# EAGLE schematic OSO-BOOK-A1-06 (EAGLE 9.6.2)

## Sheet 1 of 3
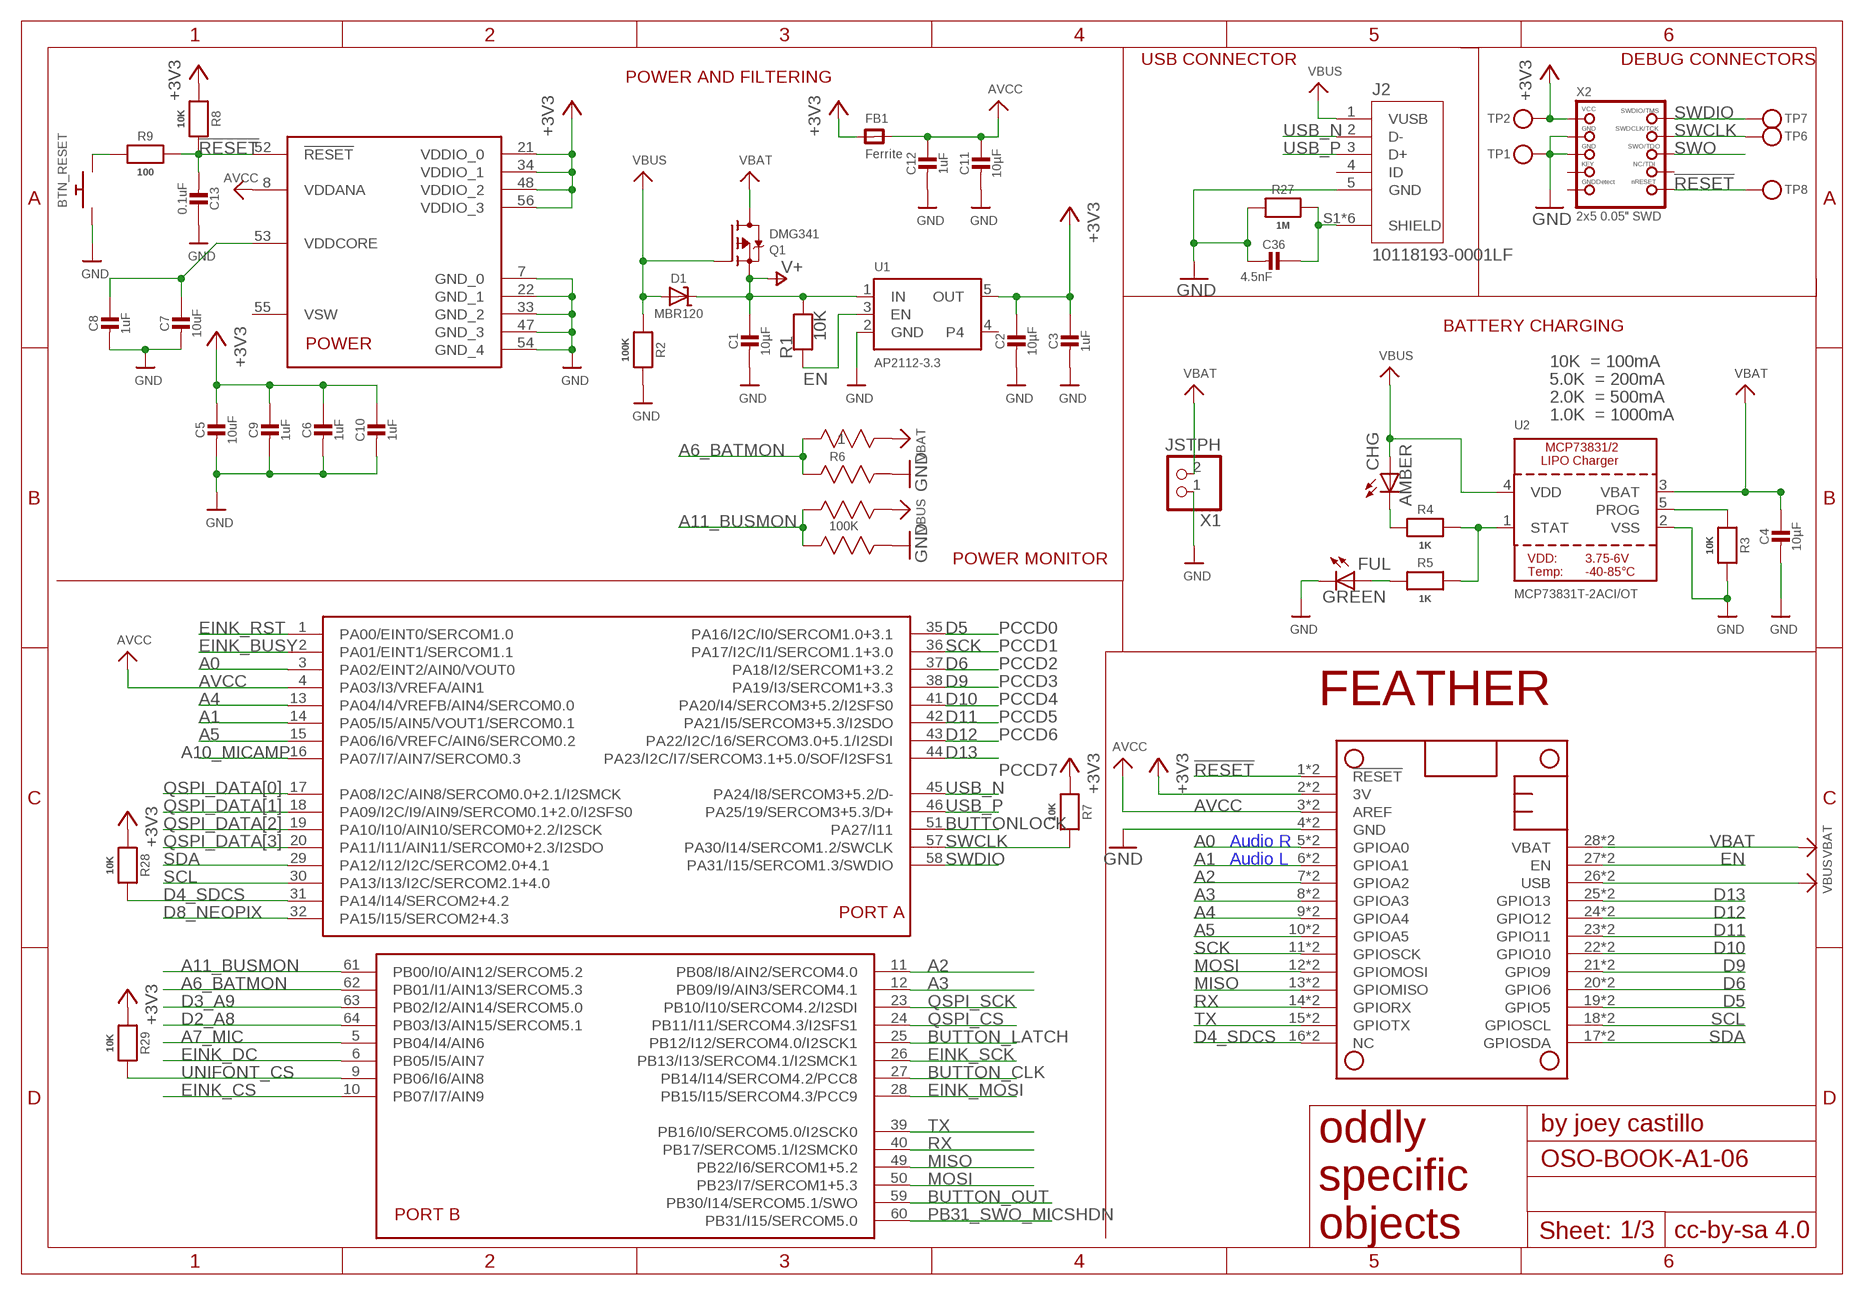
[diagram p0: schematic, sheet 1]

### Parts
BTN_RESET  SPST_TACTILE_SWITCHRA  [TL3330AF130QG]
C1  10µF  CAP_CERAMIC0805-NOOUTLINE  [0805-NO]
C2  10µF  CAP_CERAMIC0805-NOOUTLINE  [0805-NO]
C3  1uF  CAP_CERAMIC0805-NOOUTLINE  [0805-NO]
C4  10µF  CAP_CERAMIC0805-NOOUTLINE  [0805-NO]
C5  10uF  CAP_CERAMIC0805_10MGAP  [0805_10MGAP]
C6  1uF  CAP_CERAMIC0805_10MGAP  [0805_10MGAP]
C7  10uF  CAP_CERAMIC0805_10MGAP  [0805_10MGAP]
C8  1uF  CAP_CERAMIC0805_10MGAP  [0805_10MGAP]
C9  1uF  CAP_CERAMIC0805-NOOUTLINE  [0805-NO]
C10  1uF  CAP_CERAMIC0805_10MGAP  [0805_10MGAP]
C11  10µF  CAP_CERAMIC0805-NOOUTLINE  [0805-NO]
C12  1uF  CAP_CERAMIC0805-NOOUTLINE  [0805-NO]
C13  0.1uF  CAP_CERAMIC0805_10MGAP  [0805_10MGAP]
C36  4.5nF  CAP_CERAMIC0805-NOOUTLINE  [0805-NO]
CHG  AMBER  LEDCHIP-LED0805  [CHIP-LED0805]
D1  MBR120  DIODE-SCHOTTKYSOD-123  [SOD-123]
FB1  Ferrite  FERRITE0805  [0805]
FUL  GREEN  LEDCHIP-LED0805  [CHIP-LED0805]
J2  10118193-0001LF  [FCI_10118193-0001LF]
MS1  FEATHERWING_SMTDUAL  [FEATHERWING_SMT2]
Q1  DMG341  MOSFET-P  [SOT23-R]
R1  10K  RESISTOR0805_NOOUTLINE  [0805-NO]
R2  100K  RESISTOR0805_NOOUTLINE  [0805-NO]
R3  10K  RESISTOR0805_NOOUTLINE  [0805-NO]
R4  1K  RESISTOR0805_NOOUTLINE  [0805-NO]
R5  1K  RESISTOR0805_NOOUTLINE  [0805-NO]
R6  100K  EXB-V8V103JV  [EXBV8V]
R7  10K  RESISTOR0805_10MGAP  [0805_10MGAP]
R8  10K  RESISTOR0805_10MGAP  [0805_10MGAP]
R9  100  RESISTOR0805_10MGAP  [0805_10MGAP]
R27  1M  RESISTOR0805_NOOUTLINE  [0805-NO]
R28  10K  RESISTOR0805_10MGAP  [0805_10MGAP]
R29  10K  RESISTOR0805_10MGAP  [0805_10MGAP]
TP1  TESTPOINTROUND2MMNO  [TESTPOINT_ROUND_2MM_NO]
TP2  TESTPOINTROUND2MMNO  [TESTPOINT_ROUND_2MM_NO]
TP6  TESTPOINTROUND2MMNO  [TESTPOINT_ROUND_2MM_NO]
TP7  TESTPOINTROUND2MMNO  [TESTPOINT_ROUND_2MM_NO]
TP8  TESTPOINTROUND2MMNO  [TESTPOINT_ROUND_2MM_NO]
U1  AP2112-3.3  VREG_SOT23-5  [SOT23-5]
U2  MCP73831T-2ACI/OT  MCP73831/2  [SOT23-5]
U3  ATSAMD51J64-TQFP(10X10)  [TQFP64-10X10]
X1  JSTPH  CON_JST_PH_2PIN  [JSTPH2]
X2  2x5 0.05" SWD  JTAG-CORTEXBOXPOSTS  [2X05_1.27MM_BOX_POSTS]

### Nets
!RESET: C13.2 MS1.1'(!RESET) MS1.1(!RESET) R8.2 R9.2 TP8.P$1 U3.52(!RESET) X2.10(NRESET)
+3V3 [power]: C2.1 C3.1 C5.1 C6.1 C9.1 C10.1 FB1.1 MS1.2'(3V) MS1.2(3V) R7.1 R8.1 R28.1 R29.1 TP2.P$1 U1.5(OUT) U3.21(VDDIO_0) U3.34(VDDIO_1) U3.48(VDDIO_2) U3.56(VDDIO_3) X2.1(VCC) ; also sheet 2,3
A0: MS1.5'(GPIOA0) MS1.5(GPIOA0) U3.3(PA02/EINT2/AIN0/VOUT0) ; also sheet 2
A1: MS1.6'(GPIOA1) MS1.6(GPIOA1) U3.14(PA05/I5/AIN5/VOUT1/SERCOM0.1) ; also sheet 2
A2: MS1.7'(GPIOA2) MS1.7(GPIOA2) U3.11(PB08/I8/AIN2/SERCOM4.0)
A3: MS1.8'(GPIOA3) MS1.8(GPIOA3) U3.12(PB09/I9/AIN3/SERCOM4.1)
A4: MS1.9'(GPIOA4) MS1.9(GPIOA4) U3.13(PA04/I4/VREFB/AIN4/SERCOM0.0)
A5: MS1.10'(GPIOA5) MS1.10(GPIOA5) U3.15(PA06/I6/VREFC/AIN6/SERCOM0.2)
A6_BATMON: R6.1 R6.2 U3.62(PB01/I1/AIN13/SERCOM5.3)
A7_MIC: U3.5(PB04/I4/AIN6) ; also sheet 2,3
A10_MICAMP: U3.16(PA07/I7/AIN7/SERCOM0.3) ; also sheet 3
A11_BUSMON: R6.3 R6.4 U3.61(PB00/I0/AIN12/SERCOM5.2)
AVCC [power]: C11.1 C12.1 FB1.2 MS1.3'(AREF) MS1.3(AREF) U3.4(PA03/I3/VREFA/AIN1) U3.8(VDDANA) ; also sheet 2,3
BUTTON_CLK: U3.27(PB14/I14/SERCOM4.2/PCC8) ; also sheet 2
BUTTON_LATCH: U3.25(PB12/I12/SERCOM4.0/I2SCK1) ; also sheet 2
BUTTON_OUT: U3.59(PB30/I14/SERCOM5.1/SWO) ; also sheet 2
BUTTONLOCK: U3.51(PA27/I11) ; also sheet 2
D2_A8: U3.64(PB03/I3/AIN15/SERCOM5.1) ; also sheet 2
D3_A9: U3.63(PB02/I2/AIN14/SERCOM5.0) ; also sheet 2
D4_SDCS: MS1.16'(NC) MS1.16(NC) R28.2 U3.31(PA14/I14/SERCOM2+4.2) ; also sheet 2
D5: MS1.19'(GPIO5) MS1.19(GPIO5) U3.35(PA16/I2C/I0/SERCOM1.0+3.1)
D6: MS1.20'(GPIO6) MS1.20(GPIO6) U3.37(PA18/I2/SERCOM1+3.2)
D8_NEOPIX: U3.32(PA15/I15/SERCOM2+4.3) ; also sheet 2
D9: MS1.21'(GPIO9) MS1.21(GPIO9) U3.38(PA19/I3/SERCOM1+3.3)
D10: MS1.22'(GPIO10) MS1.22(GPIO10) U3.41(PA20/I4/SERCOM3+5.2/I2SFS0)
D11: MS1.23'(GPIO11) MS1.23(GPIO11) U3.42(PA21/I5/SERCOM3+5.3/I2SDO)
D12: MS1.24'(GPIO12) MS1.24(GPIO12) U3.43(PA22/I2C/16/SERCOM3.0+5.1/I2SDI)
D13: MS1.25'(GPIO13) MS1.25(GPIO13) U3.44(PA23/I2C/I7/SERCOM3.1+5.0/SOF/I2SFS1) ; also sheet 2
EINK_BUSY: U3.2(PA01/EINT1/SERCOM1.1) ; also sheet 2
EINK_CS: U3.10(PB07/I7/AIN9) ; also sheet 2
EINK_DC: U3.6(PB05/I5/AIN7) ; also sheet 2
EINK_MOSI: U3.28(PB15/I15/SERCOM4.3/PCC9) ; also sheet 2
EINK_RST: U3.1(PA00/EINT0/SERCOM1.0) ; also sheet 2
EINK_SCK: U3.26(PB13/I13/SERCOM4.1/I2SMCK1) ; also sheet 2
EN: MS1.27'(EN) MS1.27(EN) R1.1 U1.3(EN) ; also sheet 2
GND [gnd]: BTN_RESET.P$1 C1.2 C2.2 C3.2 C4.2 C5.2 C6.2 C7.2 C8.2 C9.2 C10.2 C11.2 C12.2 C13.1 C36.2 FUL.C J2.5(GND) MS1.4'(GND) MS1.4(GND) R2.2 R3.2 R6.5 R6.7 R27.2 TP1.P$1 U1.2(GND) U2.2(VSS) U3.7(GND_0) U3.22(GND_1) U3.33(GND_2) U3.47(GND_3) U3.54(GND_4) X1.1 X2.3(GND) X2.5(GND) ; also sheet 2,3
MISO: MS1.13'(GPIOMISO) MS1.13(GPIOMISO) U3.49(PB22/I6/SERCOM1+5.2) ; also sheet 2
MOSI: MS1.12'(GPIOMOSI) MS1.12(GPIOMOSI) U3.50(PB23/I7/SERCOM1+5.3) ; also sheet 2
N$1: BTN_RESET.P$2 R9.1
N$4: CHG.C R4.1
N$9: FUL.A R5.1
PB31_SWO_MICSHDN: U3.60(PB31/I15/SERCOM5.0) ; also sheet 3
PROG: R3.1 U2.5(PROG)
QSPI_CS: U3.24(PB11/I11/SERCOM4.3/I2SFS1) ; also sheet 2
QSPI_DATA[0]: U3.17(PA08/I2C/AIN8/SERCOM0.0+2.1/I2SMCK) ; also sheet 2
QSPI_DATA[1]: U3.18(PA09/I2C/I9/AIN9/SERCOM0.1+2.0/I2SFS0) ; also sheet 2
QSPI_DATA[2]: U3.19(PA10/I10/AIN10/SERCOM0+2.2/I2SCK) ; also sheet 2
QSPI_DATA[3]: U3.20(PA11/I11/AIN11/SERCOM0+2.3/I2SDO) ; also sheet 2
QSPI_SCK: U3.23(PB10/I10/SERCOM4.2/I2SDI) ; also sheet 2
RX: MS1.14'(GPIORX) MS1.14(GPIORX) U3.40(PB17/SERCOM5.1/I2SMCK0) ; also sheet 2
SCK: MS1.11'(GPIOSCK) MS1.11(GPIOSCK) U3.36(PA17/I2C/I1/SERCOM1.1+3.0) ; also sheet 2
SCL: MS1.18'(GPIOSCL) MS1.18(GPIOSCL) U3.30(PA13/I13/I2C/SERCOM2.1+4.0) ; also sheet 2
SDA: MS1.17'(GPIOSDA) MS1.17(GPIOSDA) U3.29(PA12/I12/I2C/SERCOM2.0+4.1) ; also sheet 2
SHIELD [gnd]: C36.1 J2.S1(SHIELD) J2.S2(SHIELD) J2.S3(SHIELD) J2.S4(SHIELD) J2.S5(SHIELD) J2.S6(SHIELD) R27.1
STAT: R4.2 R5.2 U2.1(STAT)
SWCLK: R7.2 TP6.P$1 U3.57(PA30/I14/SERCOM1.2/SWCLK) X2.4(SWDCLK)
SWDIO: TP7.P$1 U3.58(PA31/I15/SERCOM1.3/SWDIO) X2.2(SWDIO)
SWO: X2.6(SWO) ; also sheet 3
TX: MS1.15'(GPIOTX) MS1.15(GPIOTX) U3.39(PB16/I0/SERCOM5.0/I2SCK0) ; also sheet 2
UNIFONT_CS: R29.2 U3.9(PB06/I6/AIN8) ; also sheet 2
USB_N: J2.2(D-) U3.45(PA24/I8/SERCOM3+5.2/D-)
USB_P: J2.3(D+) U3.46(PA25/19/SERCOM3+5.3/D+)
V+ [power]: C1.1 D1.C Q1.2(S) R1.2 U1.1(IN)
VBAT [power]: C4.1 MS1.28'(VBAT) MS1.28(VBAT) Q1.3(D) R6.8 U2.3(VBAT) X1.2
VBUS [power]: CHG.A D1.A J2.1(VUSB) MS1.26'(USB) MS1.26(USB) Q1.1(G) R2.1 R6.6 U2.4(VDD)
VDDCORE2 [gnd]: C7.1 C8.1 U3.53(VDDCORE)
Unconnected: J2.4(ID) U1.4 U3.55(VSW) X2.7(KEY) X2.8(TDI) X2.9(GNDDETECT)

### Notes on the sheet
- USB CONNECTOR | DEBUG CONNECTORS
- POWER AND FILTERING
- BATTERY CHARGING
- 10K  = 100mA
- 5.0K  = 200mA
- 2.0K  = 500mA
- 1.0K  = 1000mA
- POWER MONITOR
- PCCD0
- PCCD1
- PCCD2
- PCCD3
- PCCD4 | FEATHER
- PCCD5
- PCCD6
- PCCD7
- Audio R
- Audio L

## Sheet 2 of 3
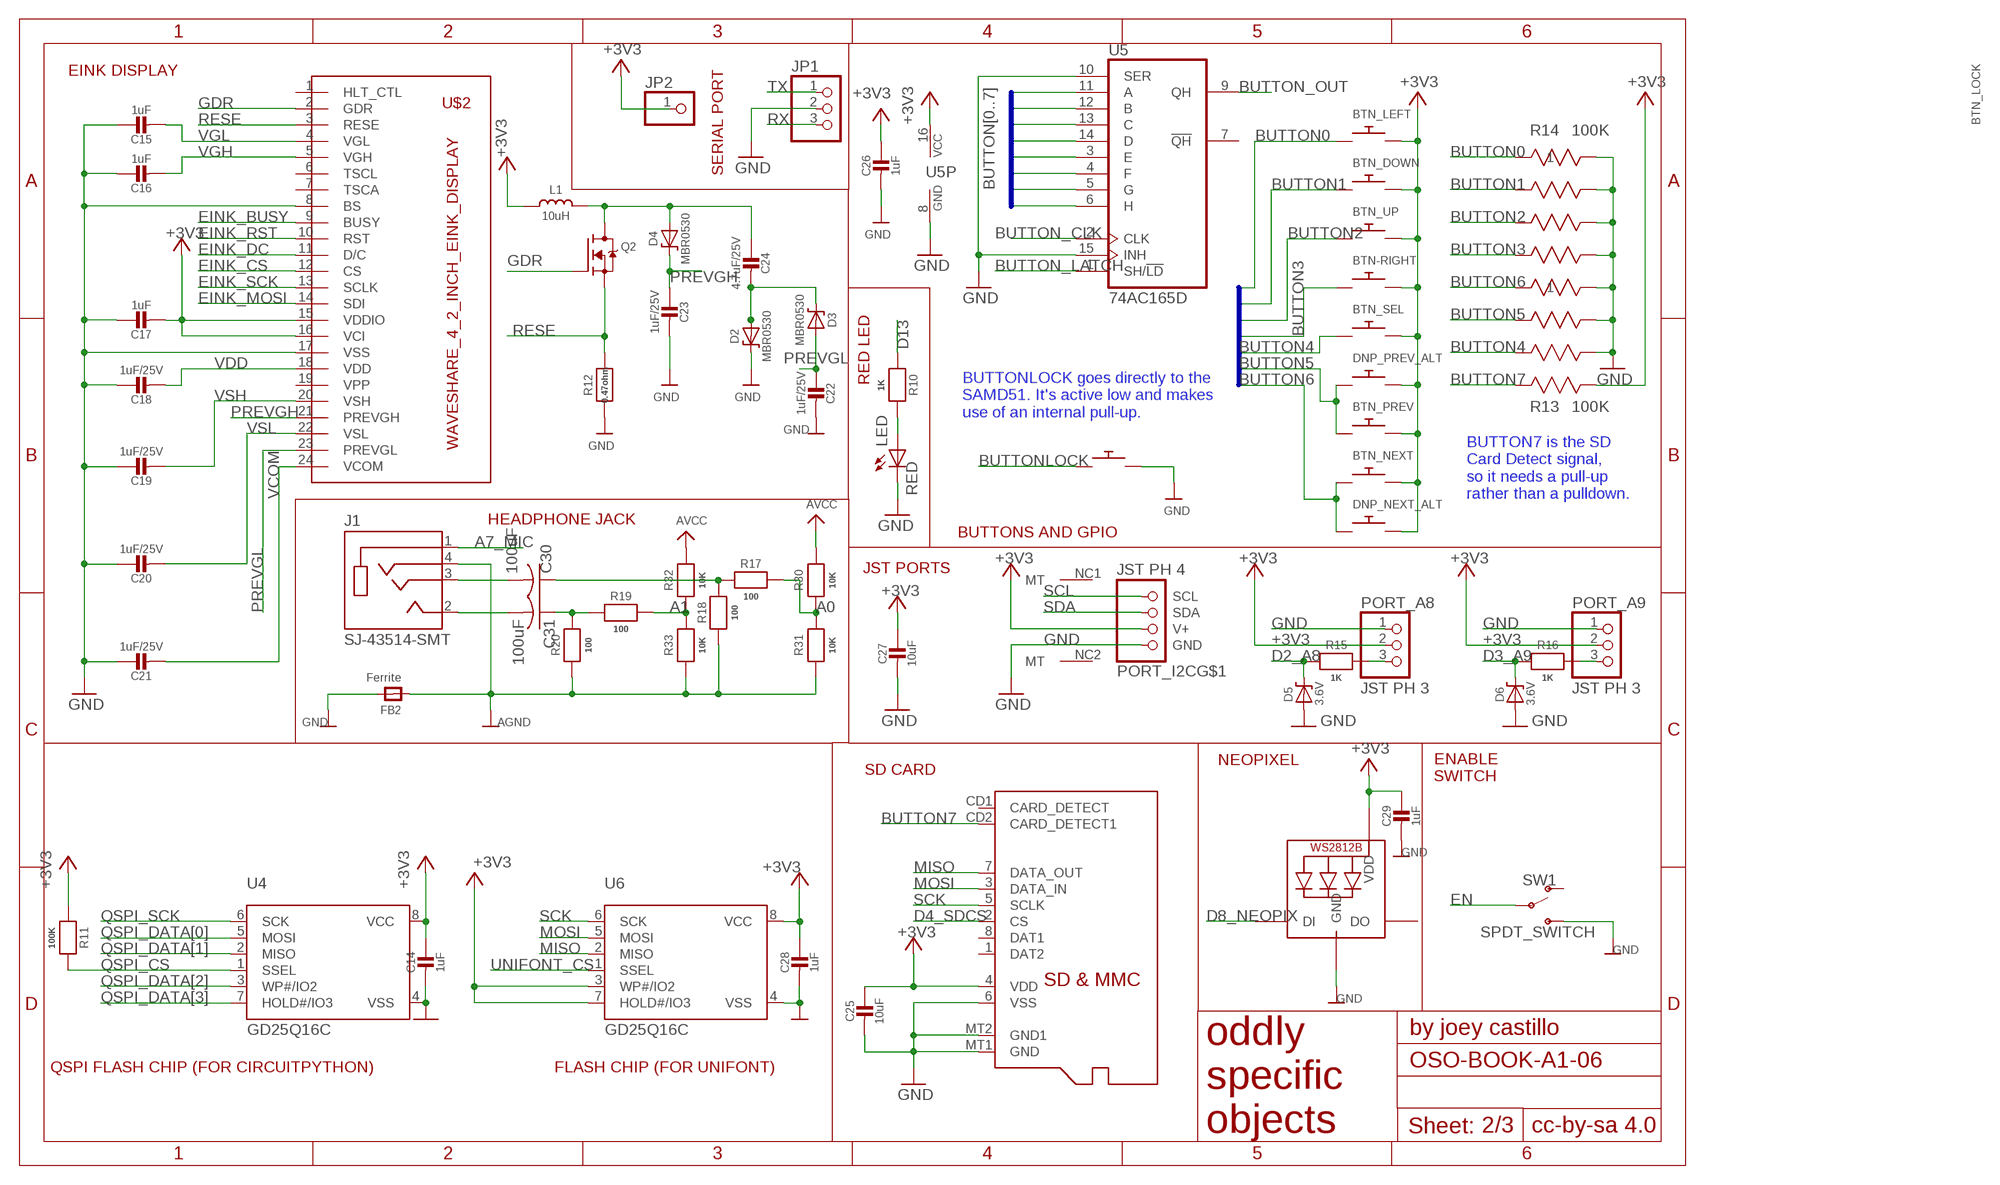
[diagram p1: schematic, sheet 2]

### Parts
BTN-RIGHT  SWITCH_PUSHBUTTONEVQ-PE  [TACT_PANA-EVQ]
BTN_DOWN  SWITCH_PUSHBUTTONEVQ-PE  [TACT_PANA-EVQ]
BTN_LEFT  SWITCH_PUSHBUTTONEVQ-PE  [TACT_PANA-EVQ]
BTN_LOCK  SPST_TACTILE_SWITCHRA  [TL3330AF130QG]
BTN_NEXT  SWITCH_PUSHBUTTONEVQ-PE  [TACT_PANA-EVQ]
BTN_PREV  SWITCH_PUSHBUTTONEVQ-PE  [TACT_PANA-EVQ]
BTN_SEL  SWITCH_PUSHBUTTONEVQ-PE  [TACT_PANA-EVQ]
BTN_UP  SWITCH_PUSHBUTTONEVQ-PE  [TACT_PANA-EVQ]
C14  1uF  CAP_CERAMIC0805-NOOUTLINE  [0805-NO]
C15  1uF  CAP_CERAMIC0805-NOOUTLINE  [0805-NO]
C16  1uF  CAP_CERAMIC0805-NOOUTLINE  [0805-NO]
C17  1uF  CAP_CERAMIC0805-NOOUTLINE  [0805-NO]
C18  1uF/25V  CAP_CERAMIC0805-NOOUTLINE  [0805-NO]
C19  1uF/25V  CAP_CERAMIC0805-NOOUTLINE  [0805-NO]
C20  1uF/25V  CAP_CERAMIC0805-NOOUTLINE  [0805-NO]
C21  1uF/25V  CAP_CERAMIC0805-NOOUTLINE  [0805-NO]
C22  1uF/25V  CAP_CERAMIC0805-NOOUTLINE  [0805-NO]
C23  1uF/25V  CAP_CERAMIC0805-NOOUTLINE  [0805-NO]
C24  4.7uF/25V  CAP_CERAMIC0805-NOOUTLINE  [0805-NO]
C25  10uF  CAP_CERAMIC0805_10MGAP  [0805_10MGAP]
C26  1uF  CAP_CERAMIC0805_10MGAP  [0805_10MGAP]
C27  10uF  CAP_CERAMIC0805-NOOUTLINE  [0805-NO]
C28  1uF  CAP_CERAMIC0805_10MGAP  [0805_10MGAP]
C29  1uF  CAP_CERAMIC0805-NOOUTLINE  [0805-NO]
C30  100uF  C-USC1210  [C1210]
C31  100uF  C-USC1210  [C1210]
D2  MBR0530  DIODE-SCHOTTKYSOD-123  [SOD-123]
D3  MBR0530  DIODE-SCHOTTKYSOD-123  [SOD-123]
D4  MBR0530  DIODE-SCHOTTKYSOD-123  [SOD-123]
D5  3.6V  DIODE-ZENERSOD123  [SOD-123]
D6  3.6V  DIODE-ZENERSOD123  [SOD-123]
DNP_NEXT_ALT  SPST_TACTILE_SWITCHRA  [TL3330AF130QG]
DNP_PREV_ALT  SPST_TACTILE_SWITCHRA  [TL3330AF130QG]
FB2  Ferrite  FERRITE0805  [0805]
J1  SJ-43514-SMT  [CUI_SJ-43514-SMT]
JP1  PINHD-1X3  [1X03]
JP2  PINHD-1X1  [1X01]
L1  10uH  MICROBUILDER_INDUCTORNR401_BIGPADS  [MICROBUILDER_INDUCTOR_4X4MM_NR401_BIGPADS]
LED  RED  LEDCHIP-LED0805  [CHIP-LED0805]
MICROSD  MICROSD  [MICROSD]
NEOPIX  WS2812B_4020  [WS2812B_4020]
PORT_A8  JST PH 3  CON_JST_PH_3PIN  [JSTPH3]
PORT_A9  JST PH 3  CON_JST_PH_3PIN  [JSTPH3]
PORT_I2C  JST PH 4  STEMMA_I2C_RASMT  [JSTPH4]
Q2  IRLML0100  IRLML2060TRPBF  [SOT23-3]
R10  1K  RESISTOR0805_NOOUTLINE  [0805-NO]
R11  100K  RESISTOR0805_NOOUTLINE  [0805-NO]
R12  0.47ohm  RESISTOR0805_10MGAP  [0805_10MGAP]
R13  100K  EXB-V8V103JV  [EXBV8V]
R14  100K  EXB-V8V103JV  [EXBV8V]
R15  1K  RESISTOR_0805MP  [_0805MP]
R16  1K  RESISTOR_0805MP  [_0805MP]
R17  100  RESISTOR0805_NOOUTLINE  [0805-NO]
R18  100  RESISTOR0805_NOOUTLINE  [0805-NO]
R19  100  RESISTOR0805_NOOUTLINE  [0805-NO]
R20  100  RESISTOR0805_NOOUTLINE  [0805-NO]
R30  10K  RESISTOR_0805MP  [_0805MP]
R31  10K  RESISTOR_0805MP  [_0805MP]
R32  10K  RESISTOR_0805MP  [_0805MP]
R33  10K  RESISTOR_0805MP  [_0805MP]
SW1  SPDT_SWITCH  [A10767]
U4  GD25Q16C  SPIFLASH_8PIN  [SOIC8_150MIL]
U5  74AC165D  [SO16]
U6  GD25Q16C  MICROBUILDER_SPIFLASH_SOIC8  [MICROBUILDER_SOIC8_150MIL]
U$2  WAVESHARE_4_2_INCH_EINK_DISPLAY  [EINK_DISPLAY_4_2IN]

### Nets
+3V3 [power]: BTN-RIGHT.P$2 BTN_DOWN.P$2 BTN_LEFT.P$2 BTN_NEXT.P$2 BTN_PREV.P$2 BTN_SEL.P$2 BTN_UP.P$2 C14.1 C17.2 C25.1 C26.1 C27.1 C28.1 C29.1 DNP_NEXT_ALT.P$2 DNP_PREV_ALT.P$2 JP2.1 L1.P$1 MICROSD.4(VDD) NEOPIX.2(VDD) PORT_A8.2 PORT_A9.2 PORT_I2C.2(V+) R11.1 R13.5 U4.8(VCC) U5.16(VCC) U6.3(WP#/IO2) U6.7(HOLD#/IO3) U6.8(VCC) U$2.15(VDDIO) U$2.16(VCI) ; also sheet 1,3
A0: R17.2 R30.2 R31.1 ; also sheet 1
A1: R19.2 R32.2 R33.1 ; also sheet 1
A7_MIC: J1.1(SLEEVE) ; also sheet 1,3
A8_: PORT_A8.3 R15.1
A9_: PORT_A9.3 R16.1
AGND [gnd]: FB2.1 J1.4(RING2) R18.1 R20.1 R31.2 R33.2 ; also sheet 3
AUDIO_LEFT: C31.2 J1.2(TIP)
AUDIO_RIGHT: C30.2 J1.3(RING1)
AVCC [power]: R30.1 R32.1 ; also sheet 1,3
BUTTON0: BTN_LEFT.P$1 R14.1 U5.11(A)
BUTTON1: BTN_DOWN.P$1 R14.2 U5.12(B)
BUTTON2: BTN_UP.P$1 R14.3 U5.13(C)
BUTTON3: BTN-RIGHT.P$1 R14.4 U5.14(D)
BUTTON4: BTN_SEL.P$1 R13.3 U5.3(E)
BUTTON5: BTN_PREV.P$1 DNP_PREV_ALT.P$1 R13.2 U5.4(F)
BUTTON6: BTN_NEXT.P$1 DNP_NEXT_ALT.P$1 R13.1 U5.5(G)
BUTTON7: MICROSD.CD2(CARD_DETECT1) R13.4 U5.6(H)
BUTTON_CLK: U5.2(CLK) ; also sheet 1
BUTTON_LATCH: U5.1(SH/!LD) ; also sheet 1
BUTTON_OUT: U5.9(QH) ; also sheet 1
BUTTONLOCK: BTN_LOCK.P$1 ; also sheet 1
D2_A8: D5.C R15.2 ; also sheet 1
D3_A9: D6.C R16.2 ; also sheet 1
D4_SDCS: MICROSD.2(CS) ; also sheet 1
D8_NEOPIX: NEOPIX.1(DI) ; also sheet 1
D13: R10.1 ; also sheet 1
EINK_BUSY: U$2.9(BUSY) ; also sheet 1
EINK_CS: U$2.12(CS) ; also sheet 1
EINK_DC: U$2.11(D/C) ; also sheet 1
EINK_MOSI: U$2.14(SDI) ; also sheet 1
EINK_RST: U$2.10(RST) ; also sheet 1
EINK_SCK: U$2.13(SCLK) ; also sheet 1
EN: SW1.P$2(P) ; also sheet 1
GDR: Q2.1(G) U$2.2(GDR)
GND [gnd]: BTN_LOCK.P$2 C14.2 C15.1 C16.1 C17.1 C18.1 C19.1 C20.1 C21.1 C22.2 C23.2 C25.2 C26.2 C27.2 C28.2 C29.2 D2.C D5.A D6.A FB2.2 JP1.2 LED.C MICROSD.6(VSS) MICROSD.MT1(GND) MICROSD.MT2(GND1) NEOPIX.4(GND) PORT_A8.1 PORT_A9.1 PORT_I2C.1(GND) R12.2 R13.6 R13.7 R13.8 R14.5 R14.6 R14.7 R14.8 SW1.P$3(S) U4.4(VSS) U5.8(GND) U5.10(SER) U5.15(INH) U6.4(VSS) U$2.8(BS) U$2.17(VSS) ; also sheet 1,3
MISO: MICROSD.7(DATA_OUT) U6.2(MISO) ; also sheet 1
MOSI: MICROSD.3(DATA_IN) U6.5(MOSI) ; also sheet 1
N$2: C24.2 D2.A D3.C
N$3: C24.1 D4.A L1.P$2 Q2.3(D)
N$7: LED.A R10.2
N$15: C31.1 R19.1 R20.2
N$70: C30.1 R17.1 R18.2
PREVGH: C23.1 D4.C U$2.21(PREVGH)
PREVGL: C22.1 D3.A U$2.23(PREVGL)
QSPI_CS: R11.2 U4.1(SSEL) ; also sheet 1
QSPI_DATA[0]: U4.5(MOSI) ; also sheet 1
QSPI_DATA[1]: U4.2(MISO) ; also sheet 1
QSPI_DATA[2]: U4.3(WP#/IO2) ; also sheet 1
QSPI_DATA[3]: U4.7(HOLD#/IO3) ; also sheet 1
QSPI_SCK: U4.6(SCK) ; also sheet 1
RESE: Q2.2(S) R12.1 U$2.3(RESE)
RX: JP1.3 ; also sheet 1
SCK: MICROSD.5(SCLK) U6.6(SCK) ; also sheet 1
SCL: PORT_I2C.4(SCL) ; also sheet 1
SDA: PORT_I2C.3(SDA) ; also sheet 1
TX: JP1.1 ; also sheet 1
UNIFONT_CS: U6.1(SSEL) ; also sheet 1
VCOM: C21.2 U$2.24(VCOM)
VDD: C18.2 U$2.18(VDD)
VGH: C16.2 U$2.5(VGH)
VGL: C15.2 U$2.4(VGL)
VSH: C19.2 U$2.20(VSH)
VSL: C20.2 U$2.22(VSL)
Unconnected: MICROSD.1(DAT2) MICROSD.8(DAT1) MICROSD.CD1(CARD_DETECT) NEOPIX.3(DO) PORT_I2C.NC1(MT) PORT_I2C.NC2(MT) SW1.P$1(O) U5.7(!QH) U$2.1(HLT_CTL) U$2.6(TSCL) U$2.7(TSCA) U$2.19(VPP)

### Buses
BUTTON[0..7]

### Notes on the sheet
- EINK DISPLAY
- SERIAL PORT
- RED LED
- BUTTONLOCK goes directly to the 
  SAMD51. It's active low and makes
  use of an internal pull-up.
- BUTTON7 is the SD 
  Card Detect signal, 
  so it needs a pull-up 
  rather than a pulldown.
- HEADPHONE JACK
- BUTTONS AND GPIO
- JST PORTS
- NEOPIXEL
- SD CARD
- ENABLE
  SWITCH
- QSPI FLASH CHIP (FOR CIRCUITPYTHON) | FLASH CHIP (FOR UNIFONT)

## Sheet 3 of 3
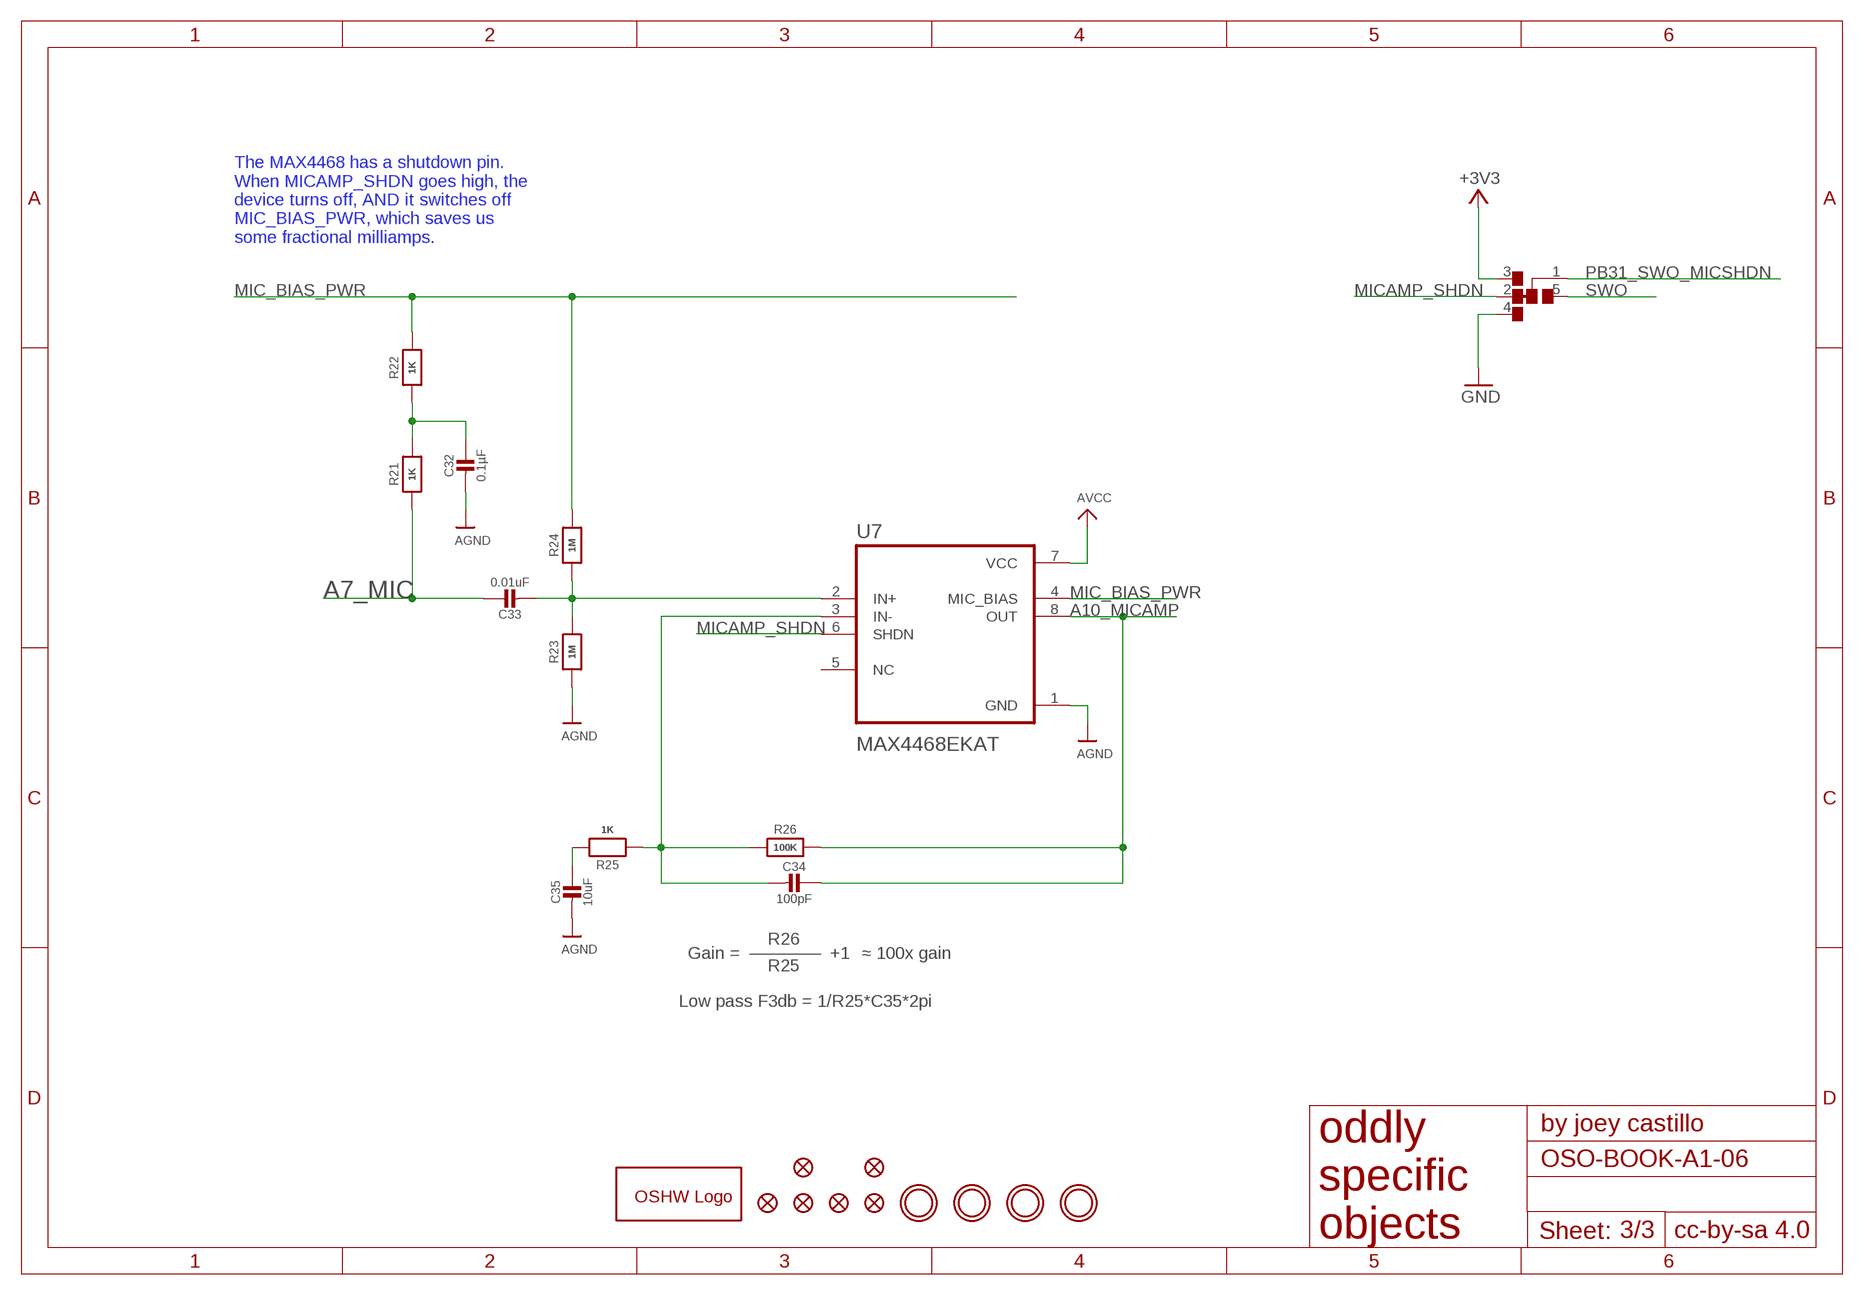
[diagram p2: schematic, sheet 3]

### Parts
C32  0.1µF  CAP_CERAMIC0805-NOOUTLINE  [0805-NO]
C33  0.01uF  CAP_CERAMIC0805-NOOUTLINE  [0805-NO]
C34  100pF  CAP_CERAMIC0805-NOOUTLINE  [0805-NO]
C35  10uF  CAP_CERAMIC0805-NOOUTLINE  [0805-NO]
FID1  FIDUCIAL_1MM  [FIDUCIAL_1MM]
FID2  FIDUCIAL_1MM  [FIDUCIAL_1MM]
FID3  FIDUCIAL_1MM  [FIDUCIAL_1MM]
FID4  FIDUCIAL_1MM  [FIDUCIAL_1MM]
FID5  FIDUCIAL_1MM  [FIDUCIAL_1MM]
FID6  FIDUCIAL_1MM  [FIDUCIAL_1MM]
GOLD_ORB_SM1  OSHWLOGOLOGO5MM  [OSHW_5MM]
R21  1K  RESISTOR0805_NOOUTLINE  [0805-NO]
R22  1K  RESISTOR0805_NOOUTLINE  [0805-NO]
R23  1M  RESISTOR0805_NOOUTLINE  [0805-NO]
R24  1M  RESISTOR0805_NOOUTLINE  [0805-NO]
R25  1K  RESISTOR0805_NOOUTLINE  [0805-NO]
R26  100K  RESISTOR0805_NOOUTLINE  [0805-NO]
SJ1  SOLDERJUMPER_FIVEWAY  [SOLDERJUMPER_FIVEWAY]
U7  MAX4468EKAT  [SOT65P280X145-8N]
U$1  MOUNTINGHOLE2.5  [MOUNTINGHOLE_2.5_PLATED]
U$4  MOUNTINGHOLE2.5  [MOUNTINGHOLE_2.5_PLATED]
U$5  MOUNTINGHOLE2.5  [MOUNTINGHOLE_2.5_PLATED]
U$7  MOUNTINGHOLE2.5  [MOUNTINGHOLE_2.5_PLATED]

### Nets
+3V3 [power]: SJ1.3 ; also sheet 1,2
A7_MIC: C33.1 R21.1 ; also sheet 1,2
A10_MICAMP: C34.1 R26.2 U7.8(OUT) ; also sheet 1
AGND [gnd]: C32.2 C35.2 R23.1 U7.1(GND) ; also sheet 2
AVCC [power]: U7.7(VCC) ; also sheet 1,2
GND [gnd]: SJ1.4 ; also sheet 1,2
MIC_BIAS_PWR: R22.2 R24.2 U7.4(MIC_BIAS)
MICAMP_SHDN: SJ1.2 U7.6(SHDN)
N$65: C32.1 R21.2 R22.1
N$67: C33.2 R23.2 R24.1 U7.2(IN+)
N$68: C34.2 R25.1 R26.1 U7.3(IN-)
N$69: C35.1 R25.2
PB31_SWO_MICSHDN: SJ1.1 ; also sheet 1
SWO: SJ1.5 ; also sheet 1
Unconnected: U7.5(NC)

### Notes on the sheet
- The MAX4468 has a shutdown pin.
  When MICAMP_SHDN goes high, the
  device turns off, AND it switches off 
  MIC_BIAS_PWR, which saves us 
  some fractional milliamps.
- R26
- Gain = | +1 | ≈ 100x gain
- R25
- Low pass F3db = 1/R25*C35*2pi

## Library data of the parts
BTN-RIGHT BTN_DOWN BTN_LEFT BTN_NEXT BTN_PREV BTN_SEL BTN_UP = adafruit:SWITCH_PUSHBUTTON: Buttons SOFTTOUCHSMD_SJ - Soft touch temporary push button (Super Junk Akihabara) Compatible with SKPMANE010 [Mouser: 688-SKPMAN] C&K_KSS = Digikey: KSS221GLFS
BTN_LOCK BTN_RESET DNP_NEXT_ALT DNP_PREV_ALT = My Stuff:SPST_TACTILE_SWITCH
C1-C29 C32-C36 = microbuilder:CAP_CERAMIC: Ceramic Capacitors For new designs, use the packages preceded by an '_' character since they are more reliable: The following footprints should be used on most boards: _0402 - Standard footprint for regular board layouts _0603 - Standard footprint for regular board layouts _0805 - Standard footprint for regular board layouts _1206 - Standard footprint for regular board layouts For extremely tight-pitch boards where space is at a premium, the following 'micro-pitch' footprints can be used (smaller pads, no silkscreen outline, etc.): _0402MP - Micro-pitch footprint for very dense/compact boards _0603MP - Micro-pitch footprint for very dense/compact boards _0805MP - Micro-pitch footprint for very dense/compact boards _1206MP - Micro-pitch footprint for very dense/compact boards
C30 C31 = resistor:C-US: CAPACITOR, American symbol
CHG FUL LED = adafruit:LED: LED OSRAM: - CHIPLED LG R971, LG N971, LY N971, LG Q971, LY Q971, LO R971, LY R971 LH N974, LH R974 LS Q976, LO Q976, LY Q976 LO Q996 - Hyper CHIPLED LW Q18S LB Q993, LB Q99A, LB R99A - SideLED LS A670, LO A670, LY A670, LG A670, LP A670 LB A673, LV A673, LT A673, LW A673 LH A674 LY A675 LS A676, LA A676, LO A676, LY A676, LW A676 LS A679, LY A679, LG A679 - Hyper Micro SIDELED® LS Y876, LA Y876, LO Y876, LY Y876 LT Y87S - SmartLED LW L88C, LW L88S LB L89C, LB L89S, LG L890 LS L89K, LO L89K, LY L89K LS L896, LA L896, LO L896, LY L896 - TOPLED LS T670, LO T670, LY T670, LG T670, LP T670 LSG T670, LSP T670, LSY T670, LOP T670, LYG T670 LG T671, LOG T671, LSG T671 LB T673, LV T673, LT T673, LW T673 LH T674 LS T676, LA T676, LO T676, LY T676, LB T676, LH T676, LSB T676, LW T676 LB T67C, LV T67C, LT T67C, LS T67K, LO T67K, LY T67K, LW E67C LS E67B, LA E67B, LO E67B, LY E67B, LB E67C, LV E67C, LT E67C LW T67C LS T679, LY T679, LG T679 LS T770, LO T770, LY T770, LG T770, LP T770 LB T773, LV T773, LT T773, LW T773 LH T774 LS E675, LA E675, LY E675, LS T675 LS T776, LA T776, LO T776, LY T776, LB T776 LHGB T686 LT T68C, LB T68C - Hyper Mini TOPLED® LB M676 - Mini TOPLED Santana® LG M470 LS M47K, LO M47K, LY M47K Source: http://www.osram.convergy.de/
D1-D4 = microbuilder:DIODE-SCHOTTKY
D5 D6 = microbuilder:DIODE-ZENER: Zener Diode SMA: 30V 1W Zener Diode, 1.2Vf - Digikey: SMAZ30-FDICT-ND
FB1 FB2 = microbuilder:FERRITE: Ferrite Bead 0603 MMZ1608B121C - 120 Ohm @ 100MHz, 600mA, 0.15 Ohm DC Resistance - Digikey: 445-2164-1-ND BK1608HW121-T - 120 Ohm, 600mA Ferrite Chip - Digikey: 587-1876-2-ND 0805 HZ0805B272R-10 - 2.7K Ohm @ 100MHz, 200mA, 0.8 Ohm DC Resistance - Digikey: 240-2504-1-ND (see also Murata BLM21BD272SN1L) MMZ2012Y152B - 1.5K Ohm @ 100MHz, 500mA, 0.4 Ohm DC Resistance - Digikey: 445-1560-1-ND - Mainly for high frequency (80-400MHz) MMZ2012R102A - 1K Ohm @ 100MHz, 500mA, 0.3 Ohm DC Resistance - Digikey: 445-1555-2-ND - More general purpose (10-200MHz)
FID1-FID6 = microbuilder:FIDUCIAL: Fiducial Alignment Points Various fiducial points for machine vision alignment.; BOM: EXCLUDE
GOLD_ORB_SM1 = oshw:OSHWLOGO: The OSHW logo for PCB layout
J1 = SJ-43514-SMT:SJ-43514-SMT: 4 conductor 3.5 mm Surface Mount Audio Jack; CUI_PURCHASE_URL: https://www.cui.com/product/interconnect/connectors/audio-connectors/jacks/sj-4351x-smt-series?utm_source=snapeda.com&utm_medium=referral&utm_campaign=snapedaBOM; DESCRIPTION: 3.5 mm, 4 Conductors, Right Angle, Surface Mount _SMT_, Audio Jack Connector; DIGI-KEY_PART_NUMBER: CP-43514SJCT-ND; DIGI-KEY_PURCHASE_URL: https://www.digikey.com/product-detail/en/cui-inc/SJ-43514-SMT-TR/CP-43514SJCT-ND/669734?utm_source=snapeda&utm_medium=aggregator&utm_campaign=symbol; MF: CUI Inc.; MP: SJ-43514-SMT-TR; PACKAGE: None
J2 = 10118193-0001LF:10118193-0001LF: Micro USB B Type Receptacle; DESCRIPTION: Single Port 5 Contact Shielded SMT MICRO USB B-Type Receptacle; DIGI-KEY_PART_NUMBER: 609-4616-1-ND; DIGI-KEY_PURCHASE_URL: https://www.digikey.com/product-detail/en/amphenol-icc-fci/10118193-0001LF/609-4616-1-ND/2785380?utm_source=snapeda&utm_medium=aggregator&utm_campaign=symbol; MF: Amphenol ICC; MP: 10118193-0001LF; PACKAGE: None
JP1 = adafruit:PINHD-1X3: PIN HEADER
JP2 = adafruit:PINHD-1X1: Pin header 1x1 for 0.1" spacing With round pins
L1 = Adafruit 3.5in 480x320 FeatherWing:MICROBUILDER_INDUCTOR: Inductors 0603: 10nH Ceramic Inductor - microwire antenna/RF (Digikey: 712-1434-2-ND) 0805: 560nH Ceramic Inductor - RF (Digikey: 553-1047-1-ND) 270nH Ceramic Inductor - Q = 40@250MHz, +-5%, 1 Ohm DC Resistance (Digikey: 535-10506-2-ND) 1007 (2518 Metric) SMT: 10µH 10% 250mOhm 820mA 1007 Inductor (Digikey: 587-2189-1-ND) 22µH 10% 500mOhm 580mA 1007 Inductor (Digikey: 587-2190-1-ND) 47µH 10% 950mOhm 420mA 1007 Inductor (Digikey: 587-2191-1-ND) 47µH 5% 100mOhm 1A 1008 Inductor (Digikey: 732-1816-1-ND) 5.0x5.0mm (Taiyo Yuden NR5040 Series) 6.8µH 20% 2.3A 64mOhm Inductor (Digikey: 587-2374-2-ND) 5.0x5.0mm (TDK VLC5045 Series) 4.7µH 20% 3.3A 34mOhm Inductor (Digikey: 445-6526-1-ND) 6.8µH 20% 2.7A 46mOhm Inductor (Digikey: 445-6527-1-ND) 6.0x6.0mm (TDK VLC6045 Series) 4.7µH 20% 3.8A 27mOhm Inductor (Digikey: 445-6538-2-ND) 6.8µH 20% 3A 41mOhm Inductor (Digikey: 445-6540-1-ND) 6.2µH 30% 2.2A 45mOhm Inductor (Digikey: SRR5028-6R2YCT-ND) - Not TDK VLC6045 but footprint should match 6.0x6.0mm (TDK SLF6045 Series) 6.8uH 30% 2A 33mOhm Inductor (Digikey: 445-4572-1-ND, Mouser: 810-SLF645T6R8N2R0PF) 6.0x6.0mm (Sumida CDRH5D28 Series) 6.2uH 30% 1.8A 45mOhm Inductor (Digikey: 308-1542-1-ND) Taiyo Yuden NR3015T2R2M - 2.2uH 20% 1.5A (Digikey: 587-1648-2-ND, Mouser: 963-NR3015T2R2M) - Used with TI TPS62172 CoilCraft RFID Transponder Coil - MA5532-AE (For use with AS3935 Lightning Sensor) Taiyo Yuden NRH2412T2R2MNGH - 2.2uH 20% 1AA (Digikey: 587-3443-1-ND) - Used with TI LM3671 Vishay IHLP 1.0uH Molded Inductor - 24mOhm DCR, 5A, +/-20%, -55°C-125°C (Digikey: 541-1319-1-ND)
MICROSD = adafruit:MICROSD: Micro-SD / Transflash card holder with SPI pinout For the 3M # 2908-05WB-MG and/or 4UCON #19656 push-push type
MS1 = pygamer-microbuilder:FEATHERWING
NEOPIX = microbuilder:WS2812B
PORT_A8 PORT_A9 = microbuilder:CON_JST_PH_3PIN
PORT_I2C = microbuilder:STEMMA_I2C
Q1 = microbuilder:MOSFET-P: P-Channel Mosfet LEGEND VDS: Voltage Drain-Source ID: Drain Current RDS(ON): Drain-Source On-State Resistance VGS(TH): Gate-Source Threshold Voltage CISS: Drain-Source Input Capacitance SOT-23 Name VDS ID RDS(ON) VGS(TH) CISS Order Number IRLML5103 30V 760mA 600 mOhm -- 75pF @ 25V Digikey: IRLML5103PBFCT-ND IRLML6401 12V 4.3A 50 mOhm 950mV @ 250µA 830pF @ 10V Digikey: IRLML6401PBFTR-ND NTR0202PL 20V 400mA 800 mOhm 2.3V @ 250uA 70pF @ 5V Digikey: NTR0202PLT1GOSTR-ND NTR4101PT1G 20V 1.8A 85 mOhm 1.2V @ 250uA 675pF @ 10V Digikey: NTR4101PT1GOSCT-ND DMP2004K 20V 600mA 900 mOhm 1V @ 250uA 175pF @ 16V Digikey: DMP2004KDICT-ND PMV65XP 20V 3.9A 76 mOhm 950mV @ 1mA 725pF @ 20V Digikey: 568-2358-2-ND TO-252 Name VDS ID RDS(ON) VGS(TH) CISS Order Number AOD417 30V 25A 34 mOhm 3V @ 250µA 920pF @ 15V Digikey: 785-1106-2-ND PowerPak Name VDS ID RDS(ON) VGS(TH) CISS Order Number AON7401 30V 12A 14 mOhm 3V @ 250µA 2600pF @ 15V Digikey: 785-1302-1-ND
Q2 = Parts:IRLML2060TRPBF
R1-R5 R7-R12 R15-R33 = microbuilder:RESISTOR: Resistors For new designs, use the packages preceded by an '_' character since they are more reliable: The following footprints should be used on most boards: _0402 - Standard footprint for regular board layouts _0603 - Standard footprint for regular board layouts _0805 - Standard footprint for regular board layouts _1206 - Standard footprint for regular board layouts For extremely tight-pitch boards where space is at a premium, the following 'micro-pitch' footprints can be used (smaller pads, no silkscreen outline, etc.): _0402MP - Micro-pitch footprint for very dense/compact boards _0603MP - Micro-pitch footprint for very dense/compact boards _0805MP - Micro-pitch footprint for very dense/compact boards _1206MP - Micro-pitch footprint for very dense/compact boards
R6 R13 R14 = resistor array:EXB-V8V103JV; MANUFACTURER_PART_NUMBER: EXBV8V103JV; VENDOR: Panasonic
SJ1 = My Stuff:SOLDERJUMPER_FIVEWAY
SW1 = My Stuff:SPDT_SWITCH
TP1 TP2 TP6-TP8 = microbuilder:TESTPOINT: Test Point Various test points for characterisation and PCB testing TESTPOINT_SMT - Compact Surface Mount Test Point [Digikey: 5016KTR-ND]
U1 = microbuilder:VREG_SOT23-5: SOT23-5 Fixed Voltage Regulators Part Current Out V Out V In V Dropout θJA (°C/W) TJ (°C) Digikey Part No. ADP121 150mA 3.3V 3.4-5.5V 0.09V @ 150mA -- -- ADP121-AUJZ33R7CT-ND ADP121 150mA 3.0V 3.1-5.5V 0.09V @ 150mA -- -- ADP121-AUJZ30R7CT-ND ADP122 300mA 3.3V 3.4-5.5V 0.085V @ 300mA -- -- ADP122AUJZ-3.3-R7CT-ND ADP1712 300mA 3.3V 3.5-5.5V 0.17V @ 300mA -- -- ADP1712AUJZ-3.3-R7TR-ND AP7311 (Low Cost) 150mA 3.3V 3.5-6V 0.15V @ 150mA -- -- AP7311-33WG-7DICT-ND LD39015M18R 150mA 1.8V 1.9V-5.5V 0.08V @ 100mA -- -- 497-6977-1-ND LP2985A-33DBVR 150mA 3.3V 3.3-16V 0.28V @ 150mA 206 150 296-18479-1-ND MCP1824T-3302E/OT 300mA 3.3V 3.5V-6V 0.2V @ 300mA -- -- MCP1824T-3302E/OTCT-ND MIC5205-2.5YM5 TR 150mA 2.5V 2.7-16V 0.165V @ 150mA -- -- 576-1257-2-ND MIC5205-3.0YM5 TR 150mA 3.0V 3.2V-16V 0.165V @ 150mA -- -- 576-1258-2-ND MIC5205-3.3YM5 TR 150mA 3.3V 3.5V-16V 0.165V @ 150mA -- -- 576-1259-2-ND TPS780330220 150mA 3.3V+2.2V 3.6-5.5V 250mV Max -- -- 296-23332-1-ND TDA3663/N1,135 100mA 3.3V 3.5-45V 0.18V @ 50mA -- -- 568-5343-1-ND Max operating temp can be calculated using θJA, TJ (max junction temperature), and power in watts. Set the "Maximum Ambient Temperature" until it reaches TJ ("Max Junction Temperature"), which is the absolute limit for safe use of the regulator: Heat Sink Temperature Calculator <http://www.daycounter.com/Calculators/Heat-Sink-Temperature-Calculator.phtml> For example, With 12V source into a 3.3V LP2985 and a 30mA load, we are dissipating (12V-3.3V) * 0.03A = 0.261W. With a θJA of 206 °C/W, a TJ of 150°C, and 261mW we can safely use the chip without a heat sink up to 75°C (=147.1°C Junction Temperature).
U2 = microbuilder:MCP73831/2: MCP73831/2 LIPO Charger VDD: 3.75 - 6V Temp -40 - 85°C Programmable Charge Rate: 15-500mA NOTE: STAT is a tri-state logic output on the MCP73831 and an open-drain output on the MCP73832. SOT23-5 with 4.2V output and tri-state logic on STAT = MCP73831T-2ACI/OT
U3 = Open Book Library:ATSAMD51J: ATSAMD51J cortex m4 microcontroller
U4 = microbuilder:SPIFLASH_8PIN: SOIC8 SPI Flash Be careful with the size since SOIC8 flash comes in several 'widths' SOIC8 150 mil M25P16 - 16Mbit (2Mbit x 8) Serial Flash (75MHz SPI Bus), Supply: 2.7-3.6V Digikey: SOIC8 - M25P16-VMN6P-ND SOIC8 208 mil W25Q16BVSSIG - 16Mbit (2Mbit x 8) Serial Flash (104MHz SPI Bus), Supply: 2.7-3.6V Digikey: SOIC8 - W25Q16BVSSIG-ND
U5 = microbuilder:74*165: 8-bit parallel load SHIFT REGISTER
U6 = Adafruit Feather M0 Express:MICROBUILDER_SPIFLASH_SOIC8: SOIC8 SPI Flash Be careful with the size since SOIC8 flash comes in several 'widths' SOIC8 150 mil M25P16 - 16Mbit (2Mbit x 8) Serial Flash (75MHz SPI Bus), Supply: 2.7-3.6V Digikey: SOIC8 - M25P16-VMN6P-ND SOIC8 208 mil W25Q16BVSSIG - 16Mbit (2Mbit x 8) Serial Flash (104MHz SPI Bus), Supply: 2.7-3.6V Digikey: SOIC8 - W25Q16BVSSIG-ND
U7 = MAX4468EKAT:MAX4468EKAT; DESCRIPTION: Audio Amp Microphone 1-CH Mono Class-AB 8-Pin SOT-23 T/R; DIGI-KEY_PART_NUMBER: MAX4468EKA+CT-ND; DIGI-KEY_PURCHASE_URL: https://www.digikey.com/product-detail/en/maxim-integrated/MAX4468EKA-T/MAX4468EKA-CT-ND/5405777?utm_source=snapeda&utm_medium=aggregator&utm_campaign=symbol; MF: Maxim Integrated; MP: MAX4468EKA+T; PACKAGE: SOT-23-8 Maxim
U$1 U$4 U$5 U$7 = microbuilder:MOUNTINGHOLE: Mounting Hole For #2 screws (0.086"/2.18mm width, 0.094"/2.4mm hole) use 2.5mm; BOM: EXCLUDE
U$2 = My Stuff:WAVESHARE_4_2_INCH_EINK_DISPLAY
X1 = microbuilder:CON_JST_PH_2PIN: JST 2-Pin Right-Angle Connector PH-Series - 4UConnector: 17311 SH-Series - 4UConnector: 07278
X2 = microbuilder:JTAG-CORTEX: Serial Wire (SW-DP) Connector Standard 0.05" 10-pin connector is for use with the Cortex M and Cortex A SWD (serial wire debugger) interface (SW-DP) Connectors 2x05_1.27MM_SMT - Inexpensive surface-mount header with bare pins, compatible with standard 10-pin SWD cables (4UCON: 16846) 2x05_1.27MM_BOX_NOPOSTS - Polarised surface-mount box (4UCON with caps: 19735, without caps: 15117 2x05_1.27MM_BOX_POSTS - Polarised surface-mount box with mounting holes (4UCON: 20317) Pinout: http://infocenter.arm.com/help/topic/com.arm.doc.faqs/attached/13634/cortex_debug_connectors.pdf http://www.keil.com/peripherals/coresight/connectors.asp

## Net classes
0 default: width 0.152 mm, drill 0.254 mm
1 power: width 0.305 mm, drill 0.305 mm
2 gnd: width 0.254 mm, drill 0.254 mm